# Altium schematic sheet Schematics.SchDoc
size A2
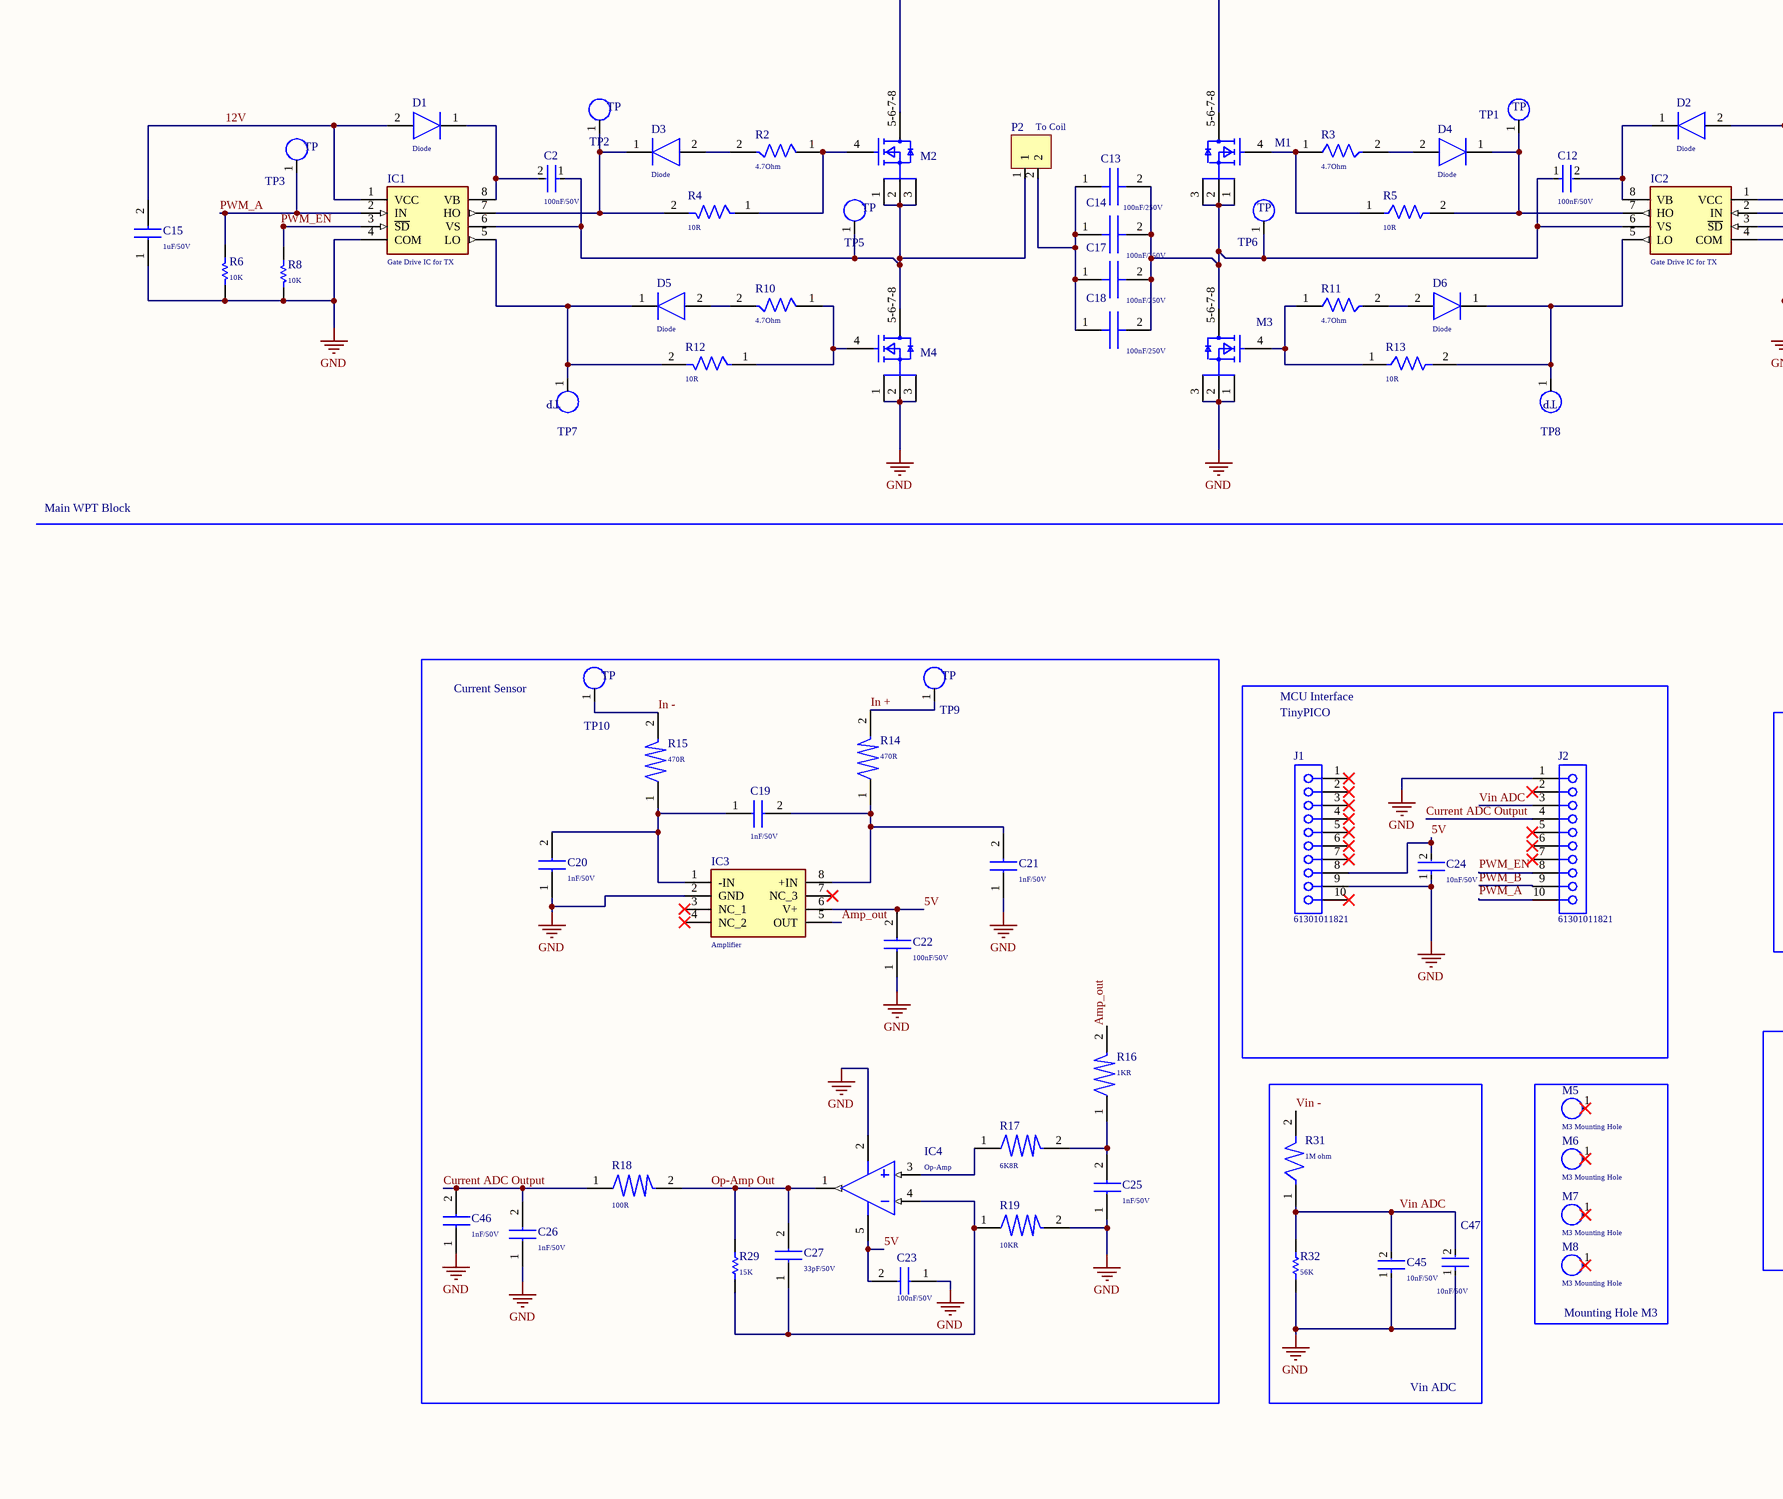
[diagram p0: Schematics.SchDoc, left]
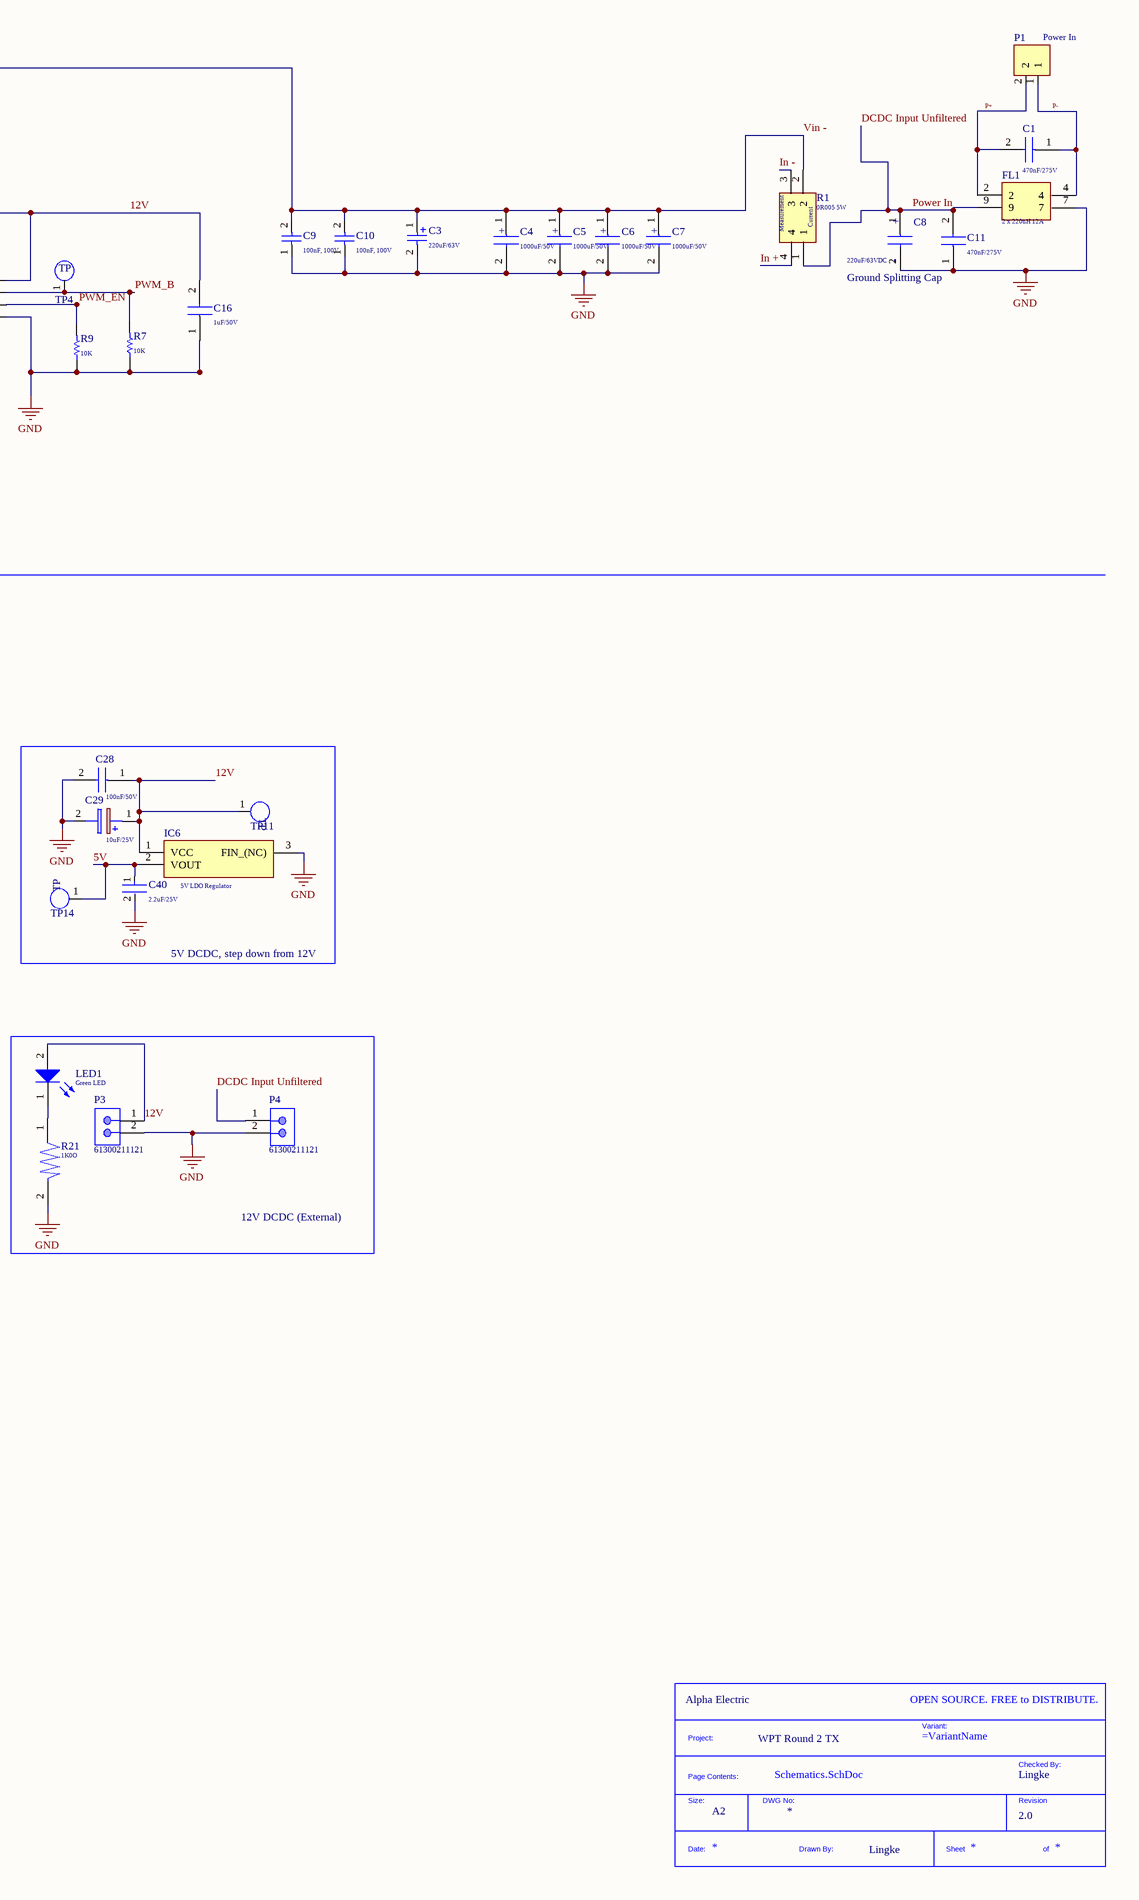
[diagram p1: Schematics.SchDoc, right]

## Parts
*  Project Name: WPT Round 2 TX  Company: Alpha Electric  Drawn By: Lingke  Revision: 2.0  Size: A2  (hidden comment: Title_Block)  (no BOM)
C1  470nF/275V  [890324025039CS]
C2  100nF/50V  [0805 Capacitor]
C3  220uF/63V  [WCAP-ATUL_D10H16]
C4  1000uF/50V  [CAPPRD500W62D1300H2650]
C5  1000uF/50V  [CAPPRD500W62D1300H2650]
C6  1000uF/50V  [CAPPRD500W62D1300H2650]
C7  1000uF/50V  [CAPPRD500W62D1300H2650]
C8  220uF/63VDC  [CAPPRD500W62D1000H2650]
C9  100nF, 100V  [WCAP-CSGP_0805_H=1.25mm]
C10  100nF, 100V  [WCAP-CSGP_0805_H=1.25mm]
C11  470nF/275V  [890324025039CS]
C12  100nF/50V  [0805 Capacitor]
C13  100nF/250V  [CAPC4532X220N]
C14  100nF/250V  [CAPC4532X220N]
C15  1uF/50V  [CAPC2012X135N]
C16  1uF/50V  [CAPC2012X135N]
C17  100nF/250V  [CAPC4532X220N]
C18  100nF/250V  [CAPC4532X220N]
C19  1nF/50V  [CAPC2012X90N]
C20  1nF/50V  [CAPC2012X90N]
C21  1nF/50V  [CAPC2012X90N]
C22  100nF/50V  [CAPC2012X90N]
C23  100nF/50V  [CAPC2012X90N]
C24  10nF/50V  [0805 Capacitor]
C25  1nF/50V  [CAPC2012X90N]
C26  1nF/50V  [CAPC2012X90N]
C27  33pF/50V  [CAPC2012X90N]
C28  100nF/50V  [CAPC2012X90N]
C29  10uF/25V  [CAPAE530X550N]
C40  2.2uF/25V  [0805 Capacitor]
C45  10nF/50V  [0805 Capacitor]
C46  1nF/50V  [CAPC2012X90N]
C47  10nF/50V  [0805 Capacitor]
D1  Diode  [SOD3716X135N]
D2  Diode  [SOD3716X135N]
D3  Diode  [SOD3716X135N]
D4  Diode  [SOD3716X135N]
D5  Diode  [SOD3716X135N]
D6  Diode  [SOD3716X135N]
FL1  2 x 220uH 12A  [744844221]
IC1  Gate Drive IC for TX  [SOIC127P600X175-8N]
IC2  Gate Drive IC for TX  [SOIC127P600X175-8N]
IC3  Amplifier  [SOIC127P600X175-8N]
IC4  Op-Amp  [ADI-RJ-5_N]
IC6  5V LDO Regulator  [ROHM_TO-252-3]
J1  61301011821  [61301011821]
J2  61301011821  [61301011821]
LED1  Green LED  [0805_A]
M1  Mosfet  [FP-PG-TDSON-8-MFG]  (value not drawn)
M2  Mosfet  [FP-PG-TDSON-8-MFG]  (value not drawn)
M3  Mosfet  [FP-PG-TDSON-8-MFG]  (value not drawn)
M4  Mosfet  [FP-PG-TDSON-8-MFG]  (value not drawn)
M5  M3 Mounting Hole  [M3 Hole]
M6  M3 Mounting Hole  [M3 Hole]
M7  M3 Mounting Hole  [M3 Hole]
M8  M3 Mounting Hole  [M3 Hole]
P1  Power In  [691404910002B]
P2  To Coil  [691404910002B]
P3  61300211121  [61300211121]
P4  61300211121  [61300211121]
R1  0R005 5W  [FC4L110R005FER]
R2  4.7Ohm  [FP-CRCW1206-e3-IPC_A]
R3  4.7Ohm  [FP-CRCW1206-e3-IPC_A]
R4  10R  [FP-CRCW1206-e3-IPC_A]
R5  10R  [FP-CRCW1206-e3-IPC_A]
R6  10K  [0805 Resistor]
R7  10K  [0805 Resistor]
R8  10K  [0805 Resistor]
R9  10K  [0805 Resistor]
R10  4.7Ohm  [FP-CRCW1206-e3-IPC_A]
R11  4.7Ohm  [FP-CRCW1206-e3-IPC_A]
R12  10R  [FP-CRCW1206-e3-IPC_A]
R13  10R  [FP-CRCW1206-e3-IPC_A]
R14  470R  [FP-CRCW0805-e3-MFG]
R15  470R  [FP-CRCW0805-e3-MFG]
R16  1KR  [FP-CRCW0805-e3-MFG]
R17  6K8R  [FP-CRCW0805-e3-MFG]
R18  100R  [FP-CRCW0805-e3-MFG]
R19  10KR  [FP-CRCW0805-e3-MFG]
R21  1K0O  [FP-CRCW0805-e3-MFG]
R29  15K  [0805 Resistor]
R31  1M ohm  [FP-CRCW0805-e3-MFG]
R32  56K  [0805 Resistor]
TP1  TP  [Test Point]  (value not drawn)  (no BOM)
TP2  TP  [Test Point]  (value not drawn)  (no BOM)
TP3  TP  [Test Point]  (value not drawn)  (no BOM)
TP4  TP  [Test Point]  (value not drawn)  (no BOM)
TP5  TP  [Test Point]  (value not drawn)  (no BOM)
TP6  TP  [Test Point]  (value not drawn)  (no BOM)
TP7  TP  [Test Point]  (value not drawn)  (no BOM)
TP8  TP  [Test Point]  (value not drawn)  (no BOM)
TP9  TP  [Test Point]  (value not drawn)  (no BOM)
TP10  TP  [Test Point]  (value not drawn)  (no BOM)
TP11  TP  [Test Point]  (value not drawn)  (no BOM)
TP14  TP  [Test Point]  (value not drawn)  (no BOM)

## Blocks framed on the sheet
Current Sensor: C19-C23 C25-C27 C46 IC3 IC4 R14-R19 R29 TP9 TP10
5V DCDC, step down from 12V: C28 C29 C40 IC6 TP11 TP14
12V DCDC (External): LED1 P3 P4 R21
Vin ADC: C45 C47 R31 R32
Mounting Hole M3: M5-M8

## Nets
GND: C3.2(N) C4.2(-) C5.2(-) C6.2(-) C7.2(-) C8.2(-) C9.1 C10.1 C11.1 C15.1 C16.1 C20.1 C21.1 C22.1 C23.1 C24.1 C25.1 C26.1 C28.2 C29.2(-) C40.2 C45.1 C46.1 C47.1 FL1.7 IC1.4(COM) IC2.4(COM) IC3.2(GND) IC4.2(-VS) IC6.3(FIN_(NC)) J1.9 J2.1 M3.1(S) M3.2(S) M3.3(S) M4.1(S) M4.2(S) M4.3(S) P3.2 P4.2 R6.1 R7.1 R8.1 R9.1 R19.2 R21.2 R32.1
5V: C22.2 C23.2 C24.2 C40.1 IC3.6(V+) IC4.5(+VS) IC6.2(VOUT) J1.8 TP14.1(TP)
12V: C15.2 C16.2 C28.1 C29.1(+) D1.2(A) D2.2(A) IC1.1(VCC) IC2.1(VCC) IC6.1(VCC) LED1.2(A) P3.1 TP11.1(TP)
Amp_out: IC3.5(OUT) R16.2
Current ADC Output: C26.2 C46.2 J2.4 R18.1
DCDC Input Unfiltered: C8.1(+) C11.2 FL1.9 P4.1 R1.1  [also labelled Power In]
In +: R1.4 R14.2 TP9.1(TP)
In -: R1.3 R15.2 TP10.1(TP)
Op-Amp Out: C27.2(C2) IC4.1(VOUT) R18.2 R29.2
P+: C1.2 FL1.2 P1.2
P-: C1.1 FL1.4 P1.1
PWM_A: IC1.2(IN) J2.10 R6.2 TP3.1(TP)
PWM_B: IC2.2(IN) J2.9 R7.2 TP4.1(TP)
PWM_EN: IC1.3(~{SD}) IC2.3(~{SD}) J2.8 R8.2 R9.2
Vin -: C3.1(P) C4.1(+) C5.1(+) C6.1(+) C7.1(+) C9.2 C10.2 M1.5-6-7-8(D) M2.5-6-7-8(D) R1.2 R31.2
Vin ADC: C45.2 C47.2 J2.3 R31.1 R32.2
NetC2_1: C2.1 IC1.6(VS) M2.1(S) M2.2(S) M2.3(S) M4.5-6-7-8(D) P2.1 TP5.1(TP)
NetC2_2: C2.2 D1.1(K) IC1.8(VB)
NetC12_1: C12.1 C13.2 C14.2 C17.2 C18.2 IC2.6(VS) M1.1(S) M1.2(S) M1.3(S) M3.5-6-7-8(D) TP6.1(TP)
NetC12_2: C12.2 D2.1(K) IC2.8(VB)
NetC13_1: C13.1 C14.1 C17.1 C18.1 P2.2
NetC19_1: C19.1 C20.2 IC3.1(-IN) R15.1
NetC19_2: C19.2 C21.2 IC3.8(+IN) R14.1
NetC25_2: C25.2 R16.1 R17.2
NetC27_1: C27.1(C1) IC4.4(-IN) R19.1 R29.1
NetD3_1: D3.1(K) IC1.7(HO) R4.2 TP2.1(TP)
NetD3_2: D3.2(A) R2.2
NetD4_1: D4.1(K) IC2.7(HO) R5.2 TP1.1(TP)
NetD4_2: D4.2(A) R3.2
NetD5_1: D5.1(K) IC1.5(LO) R12.2 TP7.1(TP)
NetD5_2: D5.2(A) R10.2
NetD6_1: D6.1(K) IC2.5(LO) R13.2 TP8.1(TP)
NetD6_2: D6.2(A) R11.2
NetIC4_3: IC4.3(+IN) R17.1
NetLED1_1: LED1.1(K) R21.1
NetM1_4: M1.4(G) R3.1 R5.1
NetM2_4: M2.4(G) R2.1 R4.1
NetM3_4: M3.4(G) R11.1 R13.1
NetM4_4: M4.4(G) R10.1 R12.1

Not connected (* = marked no-connect by the designer): IC3 3(NC_1)* 4(NC_2)* 7(NC_3)*; J1 1* 2* 3* 4* 5* 6* 7* 10*; J2 2* 5* 6* 7*; M5 1*; M6 1*; M7 1*; M8 1*

## Notes on the sheet
- Ground Splitting Cap
- Main WPT Block
- MCU Interface
- TinyPICO
- (in symbol FC4L110R005FER) Current; Measurement
- (in symbol Title_Block) OPEN SOURCE. FREE to DISTRIBUTE.; Variant:; Project:; Checked By:; Page Contents:; Size:; DWG No:; Revision; Date:; Drawn By:; Sheet; of

## Library data of the parts
* = Title_Block: Standard Title Block.; DWG No: *; Checked By: Lingke
C1 C11 = 890324025039CS: Safety Capacitor, 470nF/275V; Manufacturer_Name: Wurth Elektronik; Height: 14.5mm; Manufacturer_Part_Number: 890324025039CS
C2 C12 = 885012207098: Supplier 1: Mouser; Supplier Part Number 1: 710-885012207098
C3 = 860020775019: WCAP-ATUL Aluminum Electrolytic Capacitor, Radial, THT, D10xH16mm, 220uF/63V; Manufacturer: Wurth Elektronik; Manufacturer Part Number: 860040881014; Capacitance: 220uF; Ripple Current: 375mA; Technical Reference: ATDL410821M100DSPS1K000; Capacitance Tolerance: +/-20%; Rated Voltage: 63VDC; Leakage Current: 820uA; Endurance: 10000h; Dissipation Factor: 9%; ComponentLink1URL: http://www.we-online.de; ComponentLink1Description: Manufacturer; Published Date: October 2020; Packaging: Ammo Pack; Operating Temperature: -40 to +105degC; Mounting Technology: THT; Height: 41mm; Diameter: 18mm; ComponentLink2URL: https://www.we-online.com/catalog/datasheet/860040881014.pdf; ComponentLink2Description: Datasheet; Supplier 1: Mouser; Supplier Part Number 1: 710-860020775019
C4-C7 = ESH108M050AL4AA: Capacitor 1000uF; Supplier 1: Mouser; Supplier Part Number 1: 80-ESH108M050AL4AA
C8 = 860040775010: Polarised Cap, 220uF/63VDC; Manufacturer_Name: Wurth Elektronik; Datasheet Link: https://www.mouser.de/datasheet/2/445/860040775010-1725627.pdf; Height: 26.5mm; Manufacturer_Part_Number: 860040775010
C9 C10 = 885012207128: WCAP-CSGP Multilayer Ceramic Chip Capacitor, General Purpose, size 0805, X7R, 100nF, 100V; Manufacturer: Wurth Elektronik; Rated Voltage: 100VDC; Isolation Resistance: >=1GOhm; Capacitance Tolerance: +/-10%; Technical Reference: X7R0805104K100DFCT10000; ComponentLink1Description: Manufacturer; ComponentLink1URL: http://www.we-online.de; ComponentLink2Description: Datasheet; ComponentLink2URL: https://www.we-online.com/catalog/datasheet/885012207128.pdf; Operating Temperature: -55 to +125degC; Packaging: Tape and Reel; Manufacturer Part Number: 885012207128; Published Date: May 2020; Ceramic Type: X7R; Dissipation Factor: =<2.5%; Height: 1.25mm; Mounting Technology: SMT; Size: 0805; Capacitance: 100nF
C13 C14 C17 C18 = C1812C104JAGACAUTO: Manufacturer_Name: Kemet; Datasheet Link: https://api.kemet.com/component-edge/download/datasheet/C1812C104JAGACAUTO.pdf; Height: 2.2mm; Manufacturer_Part_Number: C1812C104JAGACAUTO; Supplier Part Number 1: 80-C1812C104JAGAUTO; Supplier 1: Mouser
C15 C16 = 885012207103: Capacitor 1uF/50V; Manufacturer_Name: Wurth Elektronik; Datasheet Link: https://katalog.we-online.com/pbs/datasheet/885012207103.pdf; Height: 1.35mm; Manufacturer_Part_Number: 885012207103; Supplier 1: Mouser; Supplier Part Number 1: 710-885012207103
C19-C21 C25 C26 C46 = 885012207086: Manufacturer_Name: Wurth Elektronik; Datasheet Link: https://katalog.we-online.com/pbs/datasheet/885012207086.pdf; Height: 0.9mm; Manufacturer_Part_Number: 885012207086; Supplier 1: Mouser; Supplier Part Number 1: 710-885012207086
C22 C23 C28 = 885012207098: Manufacturer_Name: Wurth Elektronik; Height: 0.9mm; Supplier 1: Mouser; Supplier Part Number 1: 710-885012207098
C24 C45 C47 = 885012207092: Supplier 1: Mouser; Supplier Part Number 1: 710-885012207092
C27 = C0805C330J5GACTU: Capacitor 33pF/50V; Manufacturer_Name: Kemet; Manufacturer_Part_Number: C0805C330J5GACTU; Supplier 1: Mouser; Supplier Part Number 1: 80-C0805C330J5G
C29 = 865060440001: Capacitor Polarised 10uF/25V; Manufacturer_Name: Wurth Elektronik; Datasheet Link: http://katalog.we-online.com/pbs/datasheet/865060440001.pdf; Height: 5.5mm; Manufacturer_Part_Number: 865060440001
C40 = 885012207079: Dielectric: X5R; Capacitance: 2.2; Voltage Rating (DC): 25V; Max Operating Temperature: 125°C; Case/Package: 0805; Package Quantity: 2000; Case Code (Metric): 2012; Case Code (Imperial): 0805; Supplier 1: Mouser; Supplier Part Number 1: 710-885012207079
D1-D6 = 1N4148W-E3-08: Manufacturer_Name: Vishay; Datasheet Link: https://componentsearchengine.com//1N4148W-E3-08.pdf; Height: 1.35mm; Mouser2 Part Number: 78-1N4148W-E3-08; Mouser2 Price/Stock: https://www.mouser.com/Search/Refine.aspx?Keyword=78-1N4148W-E3-08; Manufacturer_Part_Number: 1N4148W-E3-08; Supplier 1: Digi-Key; Supplier Part Number 1: 1N4148W-E3-08CT-ND
FL1 = 744844221: Common Mode Choke 220uH 12A; Manufacturer_Name: Wurth Elektronik; Height: 33mm; Manufacturer_Part_Number: 744844221
IC1 IC2 = IRS2008SPBF: Gate Drive IC; Manufacturer_Name: Infineon; Height: 1.75mm; Manufacturer_Part_Number: IRS2008SPBF; Supplier 1: Mouser; Supplier Part Number 1: 726-IRS2008SPBF
IC3 = AD8215YRZ: Integrated Circuit Amplifier; Manufacturer_Name: Analog Devices; Datasheet Link: http://www.analog.com/static/imported-files/data_sheets/AD8215.pdf; Height: 1.75mm; Manufacturer_Part_Number: AD8215YRZ; Supplier 1: Mouser; Supplier Part Number 1: 584-AD8215YRZ
IC4 = AD8031ARTZ-REEL7: Single Channel RRIO Operational Amplifier, 80 MHz BW, 35 V/us SR, Industrial, 5-pin SOT23 (RJ-5), Reel; Manufacturer: Analog Devices; Generic Part Number: AD8031; V Span Max: 12V; Slew Rate: 35V/us; Input Bias Current: 450nA; Amplifiers Per Package: 1; V Span Min: 2.7V; Iq/Amp: 900uA; Small Signal Bandwidth: 80MHz; Input Offset Voltage: 1mV; ComponentLink4URL: http://www.analog.com/en/all-operational-amplifiers-op-amps/operational-amplifiers-op-amps/ad8031/products/product.html#product-recommendations; PackageDescription: 5-Pin Small Outline Transistor Package, Body 2.9 x 1.6 mm, Pitch 0.95 mm; Mounting Technology: Surface Mount; PackageReference: RJ-5; ComponentLink2Description: Datasheet; ComponentLink1Description: Manufacturer URL; PartNumber: AD8031ARTZ-REEL7; ComponentLink2URL: http://www.analog.com/static/imported-files/data_sheets/AD8031_8032.pdf; ComponentLink3URL: http://www.analog.com/static/imported-files/packages/PKG_PDF/SOT-23(RJ)/RJ_5.pdf; ComponentLink1URL: http://www.analog.com/en/index.html; RevisionNote: Reference Circuit URL fixed; ComponentLink3Description: Package Specification; ComponentLink4Description: Reference Circuit; PackageVersion: 121608-A; DatasheetVersion: Rev. D; Packing: Reel; Code_JEDEC: MO-178-AA; Supplier 1: Mouser; Supplier Part Number 1: 584-AD8031ARTZ-R7
IC6 = BD450M5FP-CE2: Manufacturer_Name: ROHM Semiconductor; Datasheet Link: https://componentsearchengine.com//BD450M5FP-CE2.pdf; Mouser2 Part Number: 755-BD450M5FP-CE2; Mouser2 Price/Stock: https://www.mouser.com/Search/Refine.aspx?Keyword=755-BD450M5FP-CE2; Manufacturer_Part_Number: BD450M5FP-CE2
J1 J2 = 61301011821: WR-PHD Socket Header, THT, pitch 2.54mm, Single Row, Vertical, 10p; Manufacturer: Wurth Elektronik; Pin Number: 10; Rated Current: 3A; Working Voltage: 250VAC; Withstanding Voltage: 500VAC; Contact Resistance: 20mOhm; ComponentLink1Description: Manufacturer; ComponentLink1URL: http://www.we-online.de; ComponentLink2Description: Datasheet; ComponentLink2URL: https://www.we-online.com/catalog/datasheet/61301011821.pdf; Manufacturer Part Number: 61301011821; Published Date: May 2020; Pitch: 2.54mm; Operating Temperature: -40 to +125degC; Mounting Technology: THT; Packaging: Tray; Gender: Socket Header; Row Number: Single; Orientation: Vertical
LED1 = 150080GS75000: SMD mono-color Chip LED, WL-SMCW, Green; Manufacturer: Wuerth Elektronik; PackageReference: 0805_A; Color: Green; PartNumber: 150080GS75000; ComponentLink2URL: http://katalog.we-online.com/led/datasheet/150080GS75000.pdf; ComponentLink1URL: http://www.we-online.com; ComponentLink1Description: Manufacturer URL; ComponentLink2Description: Datasheet; Supplier 1: Mouser; Supplier Part Number 1: 710-150080GS75000
M1-M4 = BSC040N10NS5ATMA1: MOSFET N-CH 100V 100A 8TDSON / Mosfet Switcher; Manufacturer: Infineon; Threshold Vgs Max: 3.8V; Reverse Recovery Charge: 90nC; Number Of N Channels: 1; Input Capacitace At Vds: 4100pF @ 50V; Turn On Delay Time: 13ns; Drain To Source Resistance: 3.4mΩ; Max Junction Temp: +150°C; Transconductance: 120S; Power Dissipation: 139W; Gate Charge At Vgs: 58nC @ 10V; Threshold Vgs Min: 2.2V; Typ Forward Diode Voltage: 0.9V; Depletion Mode: False; Gate To Source Voltage: 20V; Rthja Max: 50K/W; Pulse Drain Current: 400A; Turn Off Delay Time: 32ns; Max Forward Diode Voltage: 1.1V; Reverse Recovery Time: 54ns; ComponentLink2Description: Datasheet; Temperature Range Low: -55°C; Automotive: No; Number Of Channels: 1; Mouser Description: MOSFET N-Ch 100V 100A TDSON-8; Height: 1.1mm; Temperature Range High: +150°C; Drain To Source Breakdown Voltage: 100V; Temperature: -55°C to +150°C; Device Class L3: MOSFETs; Drain To Source Voltage: 100V; Digikey Description: MOSFET N-CH 100V 100A 8TDSON; Continuous Drain Current: 100A; Package: PG-TDSON-8; Lead Free: Yes; ComponentLink2URL: https://www.infineon.com/dgdl/Infineon-BSC040N10NS5-DS-v02_02-EN.pdf?fileId=5546d4624a0bf290014a0fbcee2e6b38; Manufacturer Part Number: BSC040N10NS5ATMA1; Footprint Url: https://www.infineon.com/dgdl/Infineon-PG-TDSON-8-7-FP-v01_00-EN.pdf?fileId=5546d46259d9a4bf015a1b6adadd1f0a; Device Class L2: Transistors; Category: Trans; RoHS: TRUE; Device Class L1: Discrete Semiconductors; Octopart: https://octopart.com/bsc040n10ns5atma1-infineon-52825711; Supplier 1: Mouser; Supplier Part Number 1: 726-BSC040N10NS5ATMA
M5-M8 = M3_Mounting_hole
P1 P2 = 691404910002B: Serie 4049 B - 7.50mm Screwless Clamp Power Connector WR-TBL, 2 pin; Manufacturer: Wurth Elektronik; Pin Number: 2; Mounting Technology: THT; Operating Temperature: -40to105degC; Part Number: 691404910002B; Package Reference: 691404910002B; Manufacturer URL: http://www.we-online.de; Publisher: WurthElektronik; Packaging: Box; Datasheet URL: http://katalog.we-online.de/em/datasheet/6914049100xxB.pdf; Pitch: 7.50mm; Supplier Part Number 1: 710-691404910002B; Supplier 1: Mouser
P3 P4 = 61300211121: WR-PHD Pin Header, THT, pitch 2.54mm, Single Row, Vertical, 2p; Manufacturer: Wurth Elektronik; Pin Number: 2; Rated Current: 3A; Working Voltage: 250VAC; Withstanding Voltage: 500VAC; Contact Resistance: 20mOhm; ComponentLink1Description: Manufacturer; ComponentLink1URL: http://www.we-online.de; ComponentLink2Description: Datasheet; ComponentLink2URL: https://www.we-online.com/catalog/datasheet/61300211121.pdf; Manufacturer Part Number: 61300211121; Published Date: May 2020; Pitch: 2.54mm; Operating Temperature: -40 to +105degC; Mounting Technology: THT; Packaging: Bag; Gender: Pin Header; Row Number: Single; Orientation: Vertical
R1 = FC4L110R005FER: Resistor 0R005 5W; Manufacturer_Name: Ohmite; Height: 0.7mm; Manufacturer_Part_Number: FC4L110R005FER; Supplier 1: Mouser; Supplier Part Number 1: 588-FC4L110R005FER
R2 R3 R10 R11 = CRCW12064R70FKEA: RES Thick Film, 4.7Ω, 1%, 0.25W, 100ppm/°C, 1206 / MOSFET Gate Fast-off Resistor 4.7Ohm; Resistance: 4.7R; Power Rating: 250mW; Voltage Rating: 200V; Length: 3.2mm; Composition: Thick Film; Weight: 0.000353oz; Temperature Coefficient: 100ppm/°C; Height: 0.024inch; Case Code (Imperial): 1206; Width: 0.063inch; Number of Terminations: 2; Case Code (Metric): 3216; Features: Automotive AEC-Q200; Packaging: Tape and Reel; Tolerance: 1%; Contact Plating: Tin; Military Standard: Not; Depth: 1.6mm; Max Operating Temperature: 155°C; Number of Pins: 2; Min Operating Temperature: -55°C; Max Power Dissipation: 250mW; Mount: Surface Mount; Case/Package: 1206; Package Quantity: 10; Radiation Hardening: No; Supplier 1: Mouser; Supplier Part Number 1: 71-CRCW12064R70FKEA
R4 R5 R12 R13 = CRCW120610R0FKEA: RES Thick Film, 10Ω, 1%, 0.25W, 100ppm/°C, 1206 / MOSFET Gate Resistor 10Ohm; Power Rating: 250mW; Voltage Rating (DC): 200V; Number of Terminations: 2; Width: 0.063inch; Case Code (Imperial): 1206; Depth: 1.6mm; Contact Plating: Tin; Radiation Hardening: No; Lead Free: Lead Free; Length: 3.2mm; Tolerance: 1%; Max Power Dissipation: 250mW; Composition: Thick Film; Weight: 0.000353oz; Case/Package: 1206; Number of Pins: 2; Package Quantity: 10; Min Operating Temperature: -55°C; Military Standard: Not; Max Operating Temperature: 155°C; Termination: SMD/SMT; Case Code (Metric): 3216; Voltage Rating: 200V; Height: 0.55mm; Features: Automotive AEC-Q200; Temperature Coefficient: 100ppm/°C; Resistance: 10R; Packaging: Tape and Reel; Supplier 1: Digi-Key; Supplier Part Number 1: 541-10.0FDKR-ND
R6-R9 = CRCW080510K0FKEB: High Presicion 10K Ohm; Supplier 1: Newark; Supplier Part Number 1: 26R4046
R14 R15 = CRCW0805470RFKEB: Resistor 470 Ohm; Number of Terminations: 2; Supplier 1: Mouser; Supplier Part Number 1: 71-CRCW0805470RFKEB
R16 = CRCW08051K00FKEA: Resistor 1k Ohm; Number of Terminations: 2; Supplier 1: Mouser; Supplier Part Number 1: 71-CRCW0805-1.0K-E3
R17 = CRCW08056K80FKEA: Resistor 6.8K Ohm; Number of Terminations: 2; Supplier 1: Mouser; Supplier Part Number 1: 71-CRCW0805-6.8K-E3
R18 = CRCW0805100RFKEB: Resistor 100 Ohm; Number of Terminations: 2; Supplier 1: Mouser; Supplier Part Number 1: 71-CRCW0805100RFKEB
R19 = CRCW080510K0FKEA: Resistor 10K Ohm; Number of Terminations: 2; Supplier 1: Mouser; Supplier Part Number 1: 71-CRCW0805-10K-E3
R21 = CRCW08051K00FKEAC: Resistor 1K0 Ohm; Number of Terminations: 2; Supplier 1: Mouser; Supplier Part Number 1: 71-CRCW0805-1.0K-E3
R29 = ERA-6AED153V: 15K Ohm Resistor; Supplier 1: Mouser; Supplier Part Number 1: 667-ERA-6AED153V
R31 = CRCW08051M00FKEA: RES Thick Film, 1MΩ, 1%, 0.125W, 100ppm/°C, 0805 / 1M Ohm Resistor; Voltage Rating (DC): 150V; Resistance: 1MR; Power Rating: 125mW; Packaging: Tape and Reel; Case Code (Metric): 2012; Case/Package: 0805; Width: 1.25mm; Mount: Surface Mount; Military Standard: Not; Radiation Hardening: No; Weight: 0.000194oz; Package Quantity: 5000; Max Operating Temperature: 155°C; Contact Plating: Tin; Composition: Thick Film; Number of Pins: 2; Tolerance: 1%; Termination: SMD/SMT; Case Code (Imperial): 0805; Depth: 1.25mm; Temperature Coefficient: 100ppm/°C; Min Operating Temperature: -55°C; Height: 0.45mm; Lead Free: Lead Free; Length: 2mm; Voltage Rating: 150V; Supplier 1: Mouser; Supplier Part Number 1: 71-CRCW08051M00FKEAH
R32 = ERJ-6ENF5622V: 56K Ohm Resistor; Supplier 1: Mouser; Supplier Part Number 1: 667-ERJ-6ENF5622V
TP1-TP11 TP14 = Test Point: Test Point 1mm by 1mm